# Altium schematic sheet LTC6268_circuit.SchDoc
size A4; SheetNumber: 1; SheetTotal: 1
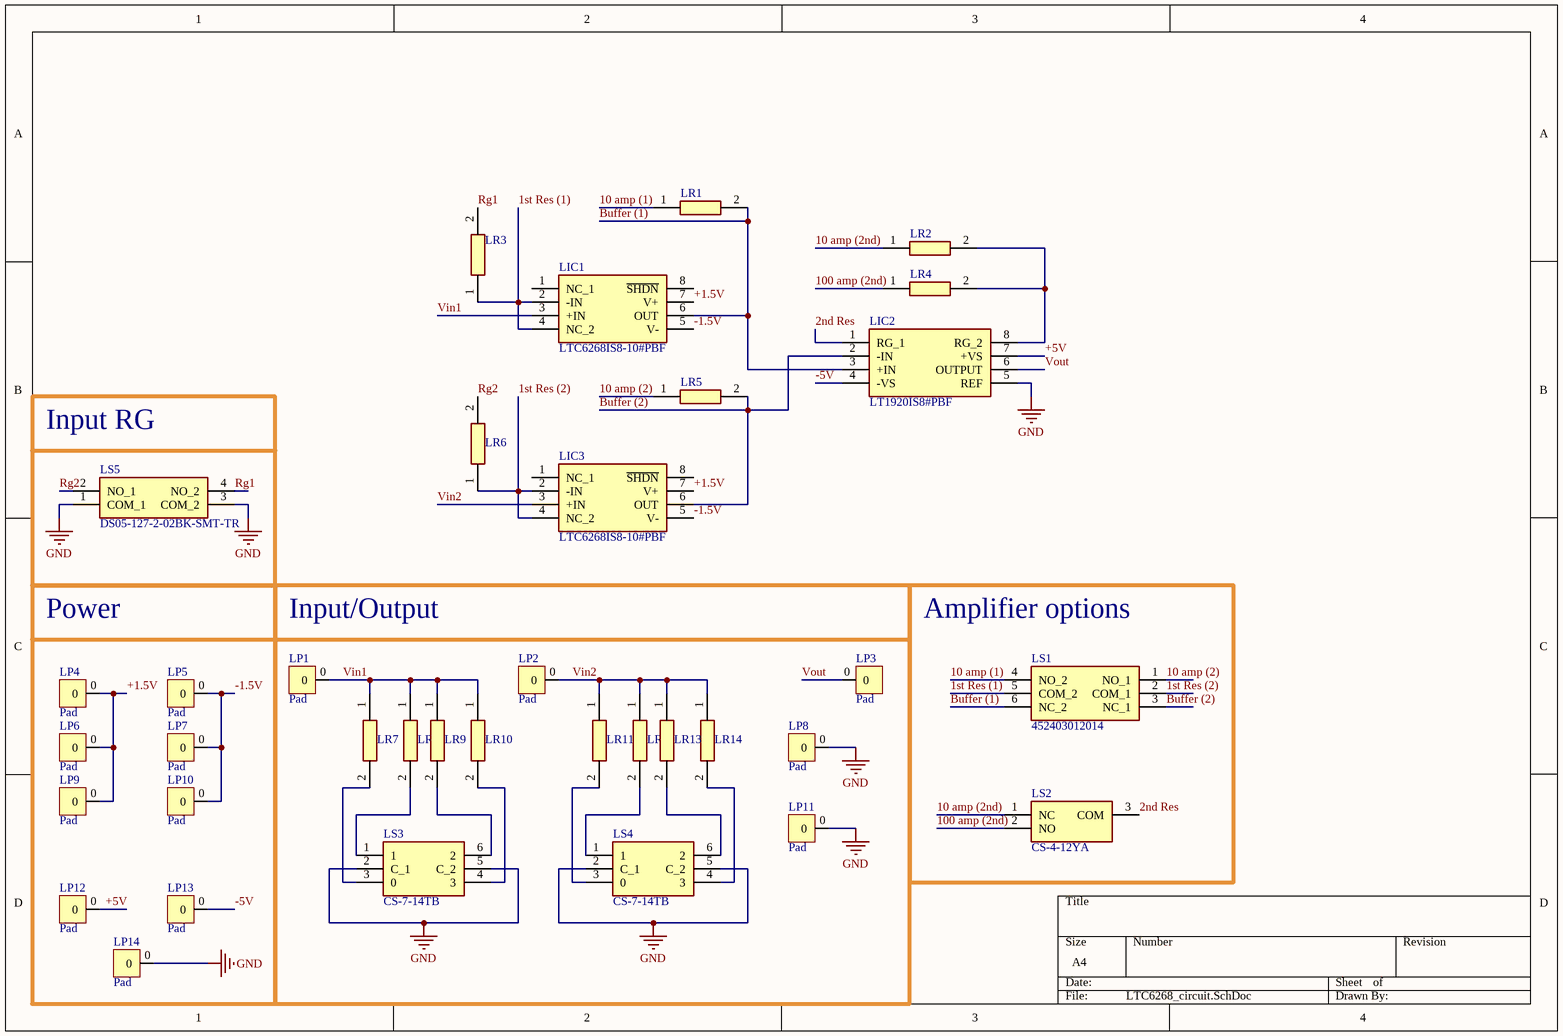
[diagram p0: LTC6268_circuit.SchDoc]

## Parts
LIC1  LTC6268IS8-10#PBF  [SOIC127P599X175-8N]
LIC2  LT1920IS8#PBF  [SOIC127P599X175-8N]
LIC3  LTC6268IS8-10#PBF  [SOIC127P599X175-8N]
LP1  Pad  [Pad]
LP2  Pad  [Pad]
LP3  Pad  [Pad]
LP4  Pad  [Pad]
LP5  Pad  [Pad]
LP6  Pad  [Pad]
LP7  Pad  [Pad]
LP8  Pad  [Pad]
LP9  Pad  [Pad]
LP10  Pad  [Pad]
LP11  Pad  [Pad]
LP12  Pad  [Pad]
LP13  Pad  [Pad]
LP14  Pad  [Pad]
LR1  CRG0805F270R  [RESC2012X65N]  (value not drawn)
LR2  CRG0805F4K7  [RESC2012X65N]  (value not drawn)
LR3  ERJ-HP6F20R0V  [ERJHP6D1000V]  (value not drawn)
LR4  CRG0805F330R  [RESC2012X65N]  (value not drawn)
LR5  CRG0805F270R  [RESC2012X65N]  (value not drawn)
LR6  ERJ-HP6F20R0V  [ERJHP6D1000V]  (value not drawn)
LR7  RH73X2A10GNTN  [RESC2013X50N]  (value not drawn)
LR8  RH73X2A50GNTN  [RESC2013X50N]  (value not drawn)
LR9  RH73H2A100MKTN  [RESC2013X50N]  (value not drawn)
LR10  RH73W2A1GNTN  [RESC2013X50N]  (value not drawn)
LR11  RH73X2A50GNTN  [RESC2013X50N]  (value not drawn)
LR12  RH73X2A10GNTN  [RESC2013X50N]  (value not drawn)
LR13  RH73W2A1GNTN  [RESC2013X50N]  (value not drawn)
LR14  RH73H2A100MKTN  [RESC2013X50N]  (value not drawn)
LS1  452403012014  [452403012014]
LS2  CS-4-12YA  [CS412YA]
LS3  CS-7-14TB  [SOP254P1000X405-6N]
LS4  CS-7-14TB  [SOP254P1000X405-6N]
LS5  DS05-127-2-02BK-SMT-TR  [DS05127202BKSMTTR]

## Blocks framed on the sheet
Input RG: LS5
Power: LP4-LP7 LP9 LP10 LP12-LP14
Input/Output: LP1-LP3 LP8 LP11 LR7-LR14 LS3 LS4
Amplifier options: LS1 LS2

## Nets
GND: LIC2.5(REF) LP8.0 LP11.0 LP14.0 LS3.2(C_1) LS3.5(C_2) LS4.2(C_1) LS4.5(C_2) LS5.1(COM_1) LS5.3(COM_2)
1st Res (1): LIC1.2(-IN) LIC1.4(NC_2) LR3.1 LS1.5(COM_2)
1st Res (2): LIC3.2(-IN) LIC3.4(NC_2) LR6.1 LS1.2(COM_1)
2nd Res: LIC2.1(RG_1) LS2.3(COM)
10 amp (1): LR1.1 LS1.4(NO_2)
10 amp (2): LR5.1 LS1.1(NO_1)
10 amp (2nd): LR2.1 LS2.1(NC)
100 amp (2nd): LR4.1 LS2.2(NO)
+1.5V: LIC1.7(V+) LIC3.7(V+) LP4.0 LP6.0 LP9.0
+5V: LIC2.7(+VS) LP12.0
-1.5V: LIC1.5(V-) LIC3.5(V-) LP5.0 LP7.0 LP10.0
-5V: LIC2.4(-VS) LP13.0
Buffer (1): LIC1.6(OUT) LIC2.3(+IN) LR1.2 LS1.6(NC_2)
Buffer (2): LIC2.2(-IN) LIC3.6(OUT) LR5.2 LS1.3(NC_1)
Rg1: LR3.2 LS5.4(NO_2)
Rg2: LR6.2 LS5.2(NO_1)
Vin1: LIC1.3(+IN) LP1.0 LR7.1 LR8.1 LR9.1 LR10.1
Vin2: LIC3.3(+IN) LP2.0 LR11.1 LR12.1 LR13.1 LR14.1
Vout: LIC2.6(OUTPUT) LP3.0
NetLIC2_8: LIC2.8(RG_2) LR2.2 LR4.2
NetLR7_2: LR7.2 LS3.3(0)
NetLR8_2: LR8.2 LS3.1
NetLR9_2: LR9.2 LS3.6(2)
NetLR10_2: LR10.2 LS3.4(3)
NetLR11_2: LR11.2 LS4.3(0)
NetLR12_2: LR12.2 LS4.1
NetLR13_2: LR13.2 LS4.6(2)
NetLR14_2: LR14.2 LS4.4(3)

Not connected (* = marked no-connect by the designer): LIC1 1(NC_1) 8(~{SHDN}); LIC3 1(NC_1) 8(~{SHDN})

## Library data of the parts
LIC1 LIC3 = LTC6268IS8-10#PBF: Integrated Circuit; Manufacturer_Name: Analog Devices; Datasheet Link: https://datasheet.datasheetarchive.com/originals/distributors/Datasheets_SAMA/eb0bf5824ac521a4901f543e1202dae7.pdf; Height: 1.752mm; Manufacturer_Part_Number: LTC6268IS8-10#PBF; Mouser Part Number: 584-LTC6268IS8-10PBF; Mouser Price/Stock: https://www.mouser.co.uk/ProductDetail/Analog-Devices/LTC6268IS8-10PBF?qs=oahfZPh6IAJW%252BkNj5oLlfA%3D%3D; Arrow Part Number: LTC6268IS8-10#PBF; Arrow Price/Stock: https://www.arrow.com/en/products/ltc6268is8-10pbf/analog-devices?region=nac; Case: SOIC-8; Mounting Style: SMD/SMT
LIC2 = LT1920IS8#PBF: Integrated Circuit; Manufacturer_Name: Analog Devices; Datasheet Link: https://datasheet.datasheetarchive.com/originals/distributors/SFDatasheet-4/sf-00091026.pdf; Height: 1.752mm; Manufacturer_Part_Number: LT1920IS8#PBF; Mouser Part Number: 584-LT1920IS8#PBF; Mouser Price/Stock: https://www.mouser.co.uk/ProductDetail/Analog-Devices/LT1920IS8PBF?qs=ytflclh7QUWOSod6PqfjSg%3D%3D; Arrow Part Number: LT1920IS8#PBF; Arrow Price/Stock: https://www.arrow.com/en/products/lt1920is8pbf/analog-devices?region=nac; Case: SOIC-8; Mounting Style: SMD/SMT
LR1 LR5 = CRG0805F270R: Resistor 270; Manufacturer_Name: TE Connectivity; Datasheet Link: http://www.te.com/commerce/DocumentDelivery/DDEController?Action=showdoc&DocId=Customer+Drawing%7F1623109%7FBA%7Fpdf%7FEnglish%7FENG_CD_1623109_BA.pdf%7F1623109-1; Height: 0.65mm; Manufacturer_Part_Number: CRG0805F270R; Mouser Part Number: 279-CRG0805F270R; Mouser Price/Stock: https://www.mouser.com/Search/Refine.aspx?Keyword=279-CRG0805F270R; Arrow Part Number: CRG0805F270R; Arrow Price/Stock: https://www.arrow.com/en/products/crg0805f270r/te-connectivity; Case: 0805 (in); Mounting Style: SMD/SMT
LR2 = CRG0805F4K7: Resistor 4.7k; Manufacturer_Name: TE Connectivity; Datasheet Link: http://www.te.com/commerce/DocumentDelivery/DDEController?Action=showdoc&DocId=Customer+Drawing%7F1623109%7FBA%7Fpdf%7FEnglish%7FENG_CD_1623109_BA.pdf%7F1623109-1; Height: 0.65mm; Manufacturer_Part_Number: CRG0805F4K7; Mouser Part Number: 279-CRG0805F4K7; Mouser Price/Stock: https://www.mouser.co.uk/ProductDetail/TE-Connectivity-Holsworthy/CRG0805F4K7?qs=VHcS2MTj4gYTCl8bEMP1DQ%3D%3D; Arrow Part Number: CRG0805F4K7; Arrow Price/Stock: https://www.arrow.com/en/products/crg0805f4k7/te-connectivity?region=nac; Case: 0805 (in); Mounting Style: SMD/SMT
LR3 LR6 = ERJ-HP6F20R0V: Resistor 20; Manufacturer_Name: Panasonic; Datasheet Link: http://industrial.panasonic.com/cdbs/www-data/pdf/RDQ0000/ast-ind-151033.pdf; Height: 0.7mm; Manufacturer_Part_Number: ERJ-HP6F20R0V
LR4 = CRG0805F330R: Resistor 330; Manufacturer_Name: TE Connectivity; Datasheet Link: http://www.te.com/commerce/DocumentDelivery/DDEController?Action=showdoc&DocId=Customer+Drawing%7F1623109%7FBA%7Fpdf%7FEnglish%7FENG_CD_1623109_BA.pdf%7F1623109-1; Height: 0.65mm; Manufacturer_Part_Number: CRG0805F330R; Mouser Part Number: 279-CRG0805F330R; Mouser Price/Stock: https://www.mouser.co.uk/ProductDetail/TE-Connectivity-Holsworthy/CRG0805F330R?qs=VHcS2MTj4gbLzLJ0%2FI3gmA%3D%3D; Arrow Part Number: CRG0805F330R; Arrow Price/Stock: https://www.arrow.com/en/products/crg0805f330r/te-connectivity?region=nac; Case: 0805 (in); Mounting Style: SMD/SMT
LR7 LR12 = RH73X2A10GNTN: Resistor 10G; Manufacturer_Name: TE Connectivity; Datasheet Link: https://ms.componentsearchengine.com/Datasheets/2/RH73X2A10GNTN.pdf; Height: 0.5mm; Manufacturer_Part_Number: RH73X2A10GNTN; Mouser Part Number: 279-RH73X2A10GNTN; Mouser Price/Stock: https://www.mouser.co.uk/ProductDetail/TE-Connectivity-Holsworthy/RH73X2A10GNTN?qs=ip69W3eHERU7YDrLGqSvdQ%3D%3D; Arrow Part Number: RH73X2A10GNTN; Arrow Price/Stock: https://www.arrow.com/en/products/rh73x2a10gntn/te-connectivity?region=nac; Case: 0805 (in); Mounting Style: SMD/SMT
LR8 LR11 = RH73X2A50GNTN: Resistor 50G; Manufacturer_Name: TE Connectivity; Datasheet Link: http://www.te.com/commerce/DocumentDelivery/DDEController?Action=showdoc&DocId=Data+Sheet%7F1773268%7FA%7Fpdf%7FEnglish%7FENG_DS_1773268_A.pdf%7F1625862-4; Height: 0.5mm; Manufacturer_Part_Number: RH73X2A50GNTN; Mouser Part Number: 279-RH73X2A50GNTN; Mouser Price/Stock: https://www.mouser.co.uk/ProductDetail/TE-Connectivity-Holsworthy/RH73X2A50GNTN?qs=ip69W3eHERVWqEnkYPnkdA%3D%3D; Case: 0805 (in); Mounting Style: SMD/SMT
LR9 LR14 = RH73H2A100MKTN: Resistor 100M; Manufacturer_Name: TE Connectivity; Datasheet Link: http://www.te.com/commerce/DocumentDelivery/DDEController?Action=showdoc&DocId=Data+Sheet%7F1773268%7FA%7Fpdf%7FEnglish%7FENG_DS_1773268_A.pdf%7F1625856-2; Height: 0.5mm; Manufacturer_Part_Number: RH73H2A100MKTN; Mouser Part Number: 279-RH73H2A100MKTN; Mouser Price/Stock: https://www.mouser.co.uk/ProductDetail/TE-Connectivity-Holsworthy/RH73H2A100MKTN?qs=ip69W3eHERW4mrE8f49Fxw%3D%3D; Arrow Part Number: RH73H2A100MKTN; Arrow Price/Stock: https://www.arrow.com/en/products/rh73h2a100mktn/te-connectivity?region=nac; Case: 0805 (in); Mounting Style: SMD/SMT
LR10 LR13 = RH73W2A1GNTN: Resistor 1G; Manufacturer_Name: TE Connectivity; Datasheet Link: https://componentsearchengine.com/Datasheets/2/RH73W2A1GNTN.pdf; Height: 0.5mm; Manufacturer_Part_Number: RH73W2A1GNTN; Mouser Part Number: 279-RH73W2A1GNTN; Mouser Price/Stock: https://www.mouser.co.uk/ProductDetail/TE-Connectivity-Holsworthy/RH73W2A1GNTN?qs=ip69W3eHERV4S8tLXHYflA%3D%3D; Arrow Part Number: RH73W2A1GNTN; Arrow Price/Stock: https://www.arrow.com/en/products/rh73w2a1gntn/te-connectivity?region=nac; Case: 0805 (in); Mounting Style: SMD/SMT
LS1 = 452403012014: Switch; Manufacturer_Name: Wurth Elektronik; Datasheet Link: https://katalog.we-online.de/em/datasheet/452403012014.pdf; Height: 3.3mm; Manufacturer_Part_Number: 452403012014; Mouser Part Number: 710-452403012014; Mouser Price/Stock: https://www.mouser.co.uk/ProductDetail/Wurth-Elektronik/452403012014?qs=DvsTirrhYfOi0QxHyAEO3w%3D%3D
LS2 = CS-4-12YA: Switch; Manufacturer_Name: NIDEC COPAL; Datasheet Link: https://www.nidec-copal-electronics.com/j/product/detail/00000197/; Height: 2.6mm; Manufacturer_Part_Number: CS-4-12YA; Mounting Style: SMD/SMT
LS3 LS4 = CS-7-14TB: Switch; Manufacturer_Name: Copal Electronics; Datasheet Link: https://www.nidec-copal-electronics.com/e/catalog/switch/cs-7.pdf; Height: 4.05mm; Manufacturer_Part_Number: CS-7-14TB; Mounting Style: SMD/SMT
LS5 = DS05-127-2-02BK-SMT-TR: Switch; Manufacturer_Name: CUI Devices; Datasheet Link: https://www.cuidevices.com/product/resource/digikeypdf/ds05-127-smt.pdf; Height: 2.6mm; Manufacturer_Part_Number: DS05-127-2-02BK-SMT-TR; Mouser Part Number: 490-DS05127202BK-STR; Mouser Price/Stock: https://www.mouser.co.uk/ProductDetail/CUI-Devices/DS05-127-2-02BK-SMT-TR?qs=wnTfsH77Xs6TIyf6yhikhg%3D%3D; Mounting Style: SMD/SMT